# Altium schematic sheet SenorsIn.SchDoc
size A4; SheetNumber: 2; SheetTotal: 9
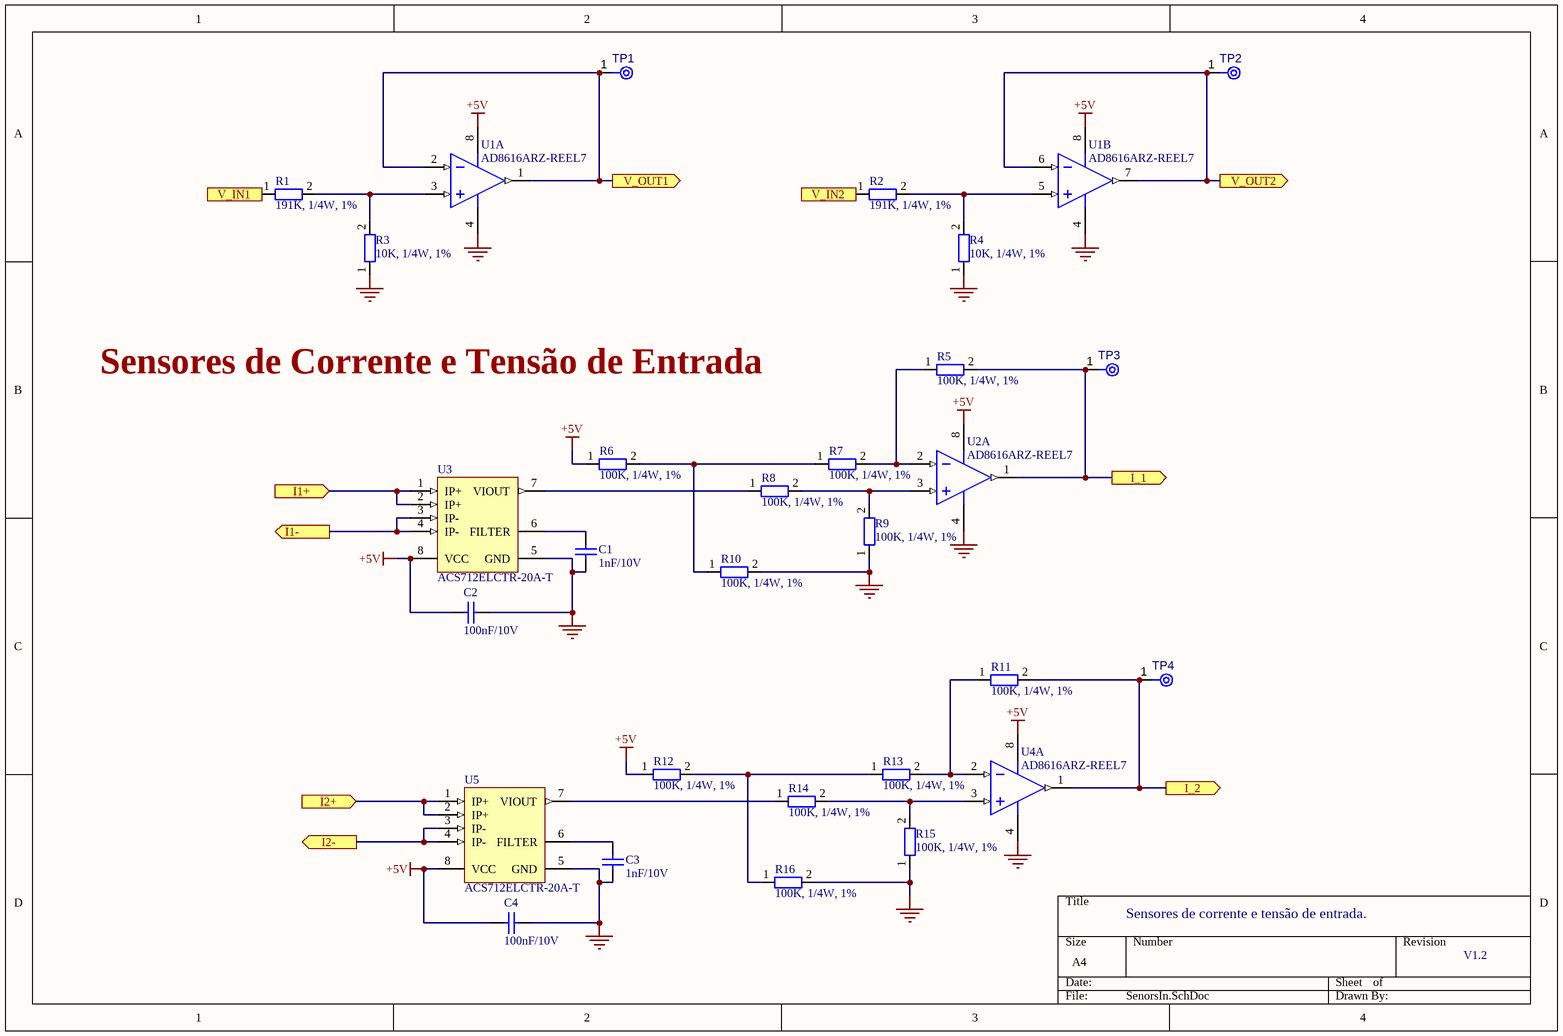
[diagram p0: SenorsIn.SchDoc]

## Parts
C1  value 1nF/10V  [C1206]  (hidden comment: Cap Semi)
C2  value 100nF/10V  [C1206]  (hidden comment: Cap Semi)
C3  value 1nF/10V  [C1206]  (hidden comment: Cap Semi)
C4  value 100nF/10V  [C1206]  (hidden comment: Cap Semi)
R1  191K, 1/4W, 1%  [RESC3216X60N]
R2  191K, 1/4W, 1%  [RESC3216X60N]
R3  10K, 1/4W, 1%  [RES-0805]
R4  10K, 1/4W, 1%  [RES-0805]
R5  100K, 1/4W, 1%  [RES-0805]
R6  100K, 1/4W, 1%  [RES-0805]
R7  100K, 1/4W, 1%  [RES-0805]
R8  100K, 1/4W, 1%  [RES-0805]
R9  100K, 1/4W, 1%  [RES-0805]
R10  100K, 1/4W, 1%  [RES-0805]
R11  100K, 1/4W, 1%  [RES-0805]
R12  100K, 1/4W, 1%  [RES-0805]
R13  100K, 1/4W, 1%  [RES-0805]
R14  100K, 1/4W, 1%  [RES-0805]
R15  100K, 1/4W, 1%  [RES-0805]
R16  100K, 1/4W, 1%  [RES-0805]
TP1  TPAD6R  [TP06R]  (value not drawn)  (no BOM)
TP2  TPAD6R  [TP06R]  (value not drawn)  (no BOM)
TP3  TPAD6R  [TP06R]  (value not drawn)  (no BOM)
TP4  TPAD6R  [TP06R]  (value not drawn)  (no BOM)
U1  AD8616ARZ-REEL7  [ADI-R-8_M]  (parts A,B of 2)
U2  AD8616ARZ-REEL7  [ADI-R-8_N]  (part A of 2)
U3  ACS712ELCTR-20A-T  [ALEG-LC-8_V]
U4  AD8616ARZ-REEL7  [ADI-R-8_N]  (part A of 2)
U5  ACS712ELCTR-20A-T  [ALEG-LC-8_V]

## Ports
I1+ (in), I1- (out), I2+ (in), I2- (out), I_1 (out), I_2 (out), V_IN1 (in), V_IN2 (in), V_OUT1 (out), V_OUT2 (out)

## Nets
+5V: C2.2 C4.2 R6.1 R12.1 U1.8(+V) U2.8(+V) U3.8(VCC) U4.8(+V) U5.8(VCC)
GND: C1.1 C2.1 C3.1 C4.1 R3.1 R4.1 R9.1 R10.2 R15.1 R16.2 U1.4(-V) U2.4(-V) U3.5(GND) U4.4(-V) U5.5(GND)
I1+: U3.1(IP+) U3.2(IP+) ; port I1+
I1-: U3.3(IP-) U3.4(IP-) ; port I1-
I2+: U5.1(IP+) U5.2(IP+) ; port I2+
I2-: U5.3(IP-) U5.4(IP-) ; port I2-
I_1: R5.2 TP3.1(TP) U2.1(OUT_A) ; port I_1
I_2: R11.2 TP4.1(TP) U4.1(OUT_A) ; port I_2
V_IN1: R1.1 ; port V_IN1
V_IN2: R2.1 ; port V_IN2
V_OUT1: TP1.1(TP) U1.1(OUT_A) U1.2(-IN_A) ; port V_OUT1
V_OUT2: TP2.1(TP) U1.6(-IN_B) U1.7(OUT_B) ; port V_OUT2
NetC1_2: C1.2 U3.6(FILTER)
NetC3_2: C3.2 U5.6(FILTER)
NetR1_2: R1.2 R3.2 U1.3(+IN_A)
NetR2_2: R2.2 R4.2 U1.5(+IN_B)
NetR5_1: R5.1 R7.2 U2.2(-IN_A)
NetR6_2: R6.2 R7.1 R10.1
NetR8_1: R8.1 U3.7(VIOUT)
NetR8_2: R8.2 R9.2 U2.3(+IN_A)
NetR11_1: R11.1 R13.2 U4.2(-IN_A)
NetR12_2: R12.2 R13.1 R16.1
NetR14_1: R14.1 U5.7(VIOUT)
NetR14_2: R14.2 R15.2 U4.3(+IN_A)

## Notes on the sheet
- Sensores de Corrente e Tensão de Entrada
- Sensores de corrente e tensão de entrada.
- V1.2

## Library data of the parts
C1 C3 = Cap Semi: KEMET - C0805C102K8RACTU - MLCC CAPACITOR, 1000PF, 10V, X7R, 10%, 0805, FULL REEL; Dielectric Material: Ceramic; Capacitance: 1nF; Published: 8-Jun-2000; LatestRevisionDate: 29-May-2009; LatestRevisionNote: IPC-7351 Footprint Added.; PackageReference: C1206; Publisher: Altium Limited; PackageDescription: Chip Capacitor; Supplier 1: Mouser; Supplier Part Number 1: 80-C0805C102K8R; Manufacturer: KEMET; Manufacturer Part Number: C0805C102K8RACTU; RoHS: Yes; Category: Ceramic Capacitors; Stock 1: 10223; Pricing 1: 1=0.30000, 10=0.15600, 50=0.15600, 100=0.09300, 1000=0.07300, 10000=0.05100 (USD); Mount: Surface Mount; Case/Package: 0805; Case Code (Metric): 2012; Case Code (Imperial): 0805; Contact Plating: Tin,Matte; Min Operating Temperature: -55°C; Max Operating Temperature: 125°C; Voltage Rating: 10V; Tolerance: 10%; Packaging: Tape and Reel; Package Quantity: 1; Voltage Rating (DC): 10V; Dielectric: X7R; Termination: SMD/SMT; Series: C; Construction: Flat; Length: 2mm; Width: 0.049inch; Height: 0.78mm; Thickness: 0.035inch; REACH SVHC: No SVHC; RoHS Compliant: Yes; ComponentLink1URL: http://www.mouser.com/ds/2/212/KEM_C1002_X7R_SMD-1102033.pdf?src-supplier=Mouser; ComponentLink1Description: http://www.mouser.com/ds/2/212/KEM_C1002_X7R_SMD-1102033.pdf?src-supplier=Mouser; ComponentLink2URL: https://search.kemet.com/component-edge/download/datasheet/C0805C102K8RACTU.pdf?src-supplier=Digi-Key; ComponentLink2Description: https://search.kemet.com/component-edge/download/datasheet/C0805C102K8RACTU.pdf?src-supplier=Digi-Key; ComponentLink3URL: https://api.kemet.com/component-edge/download/datasheet/C0805C102K8RACTU.pdf?src-supplier=Digi-Key; ComponentLink3Description: https://api.kemet.com/component-edge/download/datasheet/C0805C102K8RACTU.pdf?src-supplier=Digi-Key; ComponentLink4URL: http://capacitoredge.kemet.com/capedge2/DataSheet?pn=C0805C102K8RACTU&src-supplier=Avnet; ComponentLink4Description: http://capacitoredge.kemet.com/capedge2/DataSheet?pn=C0805C102K8RACTU&src-supplier=Avnet; ComponentLink5URL: http://www.farnell.com/datasheets/2627200.pdf?src-supplier=Newark; ComponentLink5Description: http://www.farnell.com/datasheets/2627200.pdf?src-supplier=Newark
C2 C4 = Cap Semi: Multilayer Ceramic Capacitors MLCC - SMD/SMT 10volts 0.1uF X7R 20%; Manufacturer: KEMET; Manufacturer Part Number: C1206C104M8RACTU; Capacitance: 100nF; Voltage Rating: 10V; Published: 8-Jun-2000; LatestRevisionDate: 29-May-2009; LatestRevisionNote: IPC-7351 Footprint Added.; PackageReference: C1206; Publisher: Altium Limited; PackageDescription: Chip Capacitor; Supplier 1: Mouser; Supplier Part Number 1: 80-C1206C104M8R; RoHS: Yes; Category: Ceramic Capacitors; Stock 1: 1591; Pricing 1: 1=0.41000, 10=0.24000, 50=0.24000, 100=0.15000, 1000=0.12000, 10000=0.08000 (USD); Mount: Surface Mount; Case/Package: 1206; Case Code (Metric): 3216; Case Code (Imperial): 1206; Weight: 0.000571oz; Dielectric Material: Ceramic; Min Operating Temperature: -55°C; Max Operating Temperature: 125°C; Package Quantity: 4000; Tolerance: 20%; Packaging: Tape and Reel; Voltage Rating (DC): 10V; Dielectric: X7R; Termination: SMD/SMT; Series: C; Construction: Flat; Length: 3.2mm; Width: 0.063inch; Height: 0.78mm; Thickness: 0.035inch; Depth: 1.6mm; RoHS Compliant: Yes; ComponentLink1URL: http://www.mouser.com/ds/2/212/KEM_C1002_X7R_SMD-1102033.pdf?src-supplier=Mouser; ComponentLink1Description: http://www.mouser.com/ds/2/212/KEM_C1002_X7R_SMD-1102033.pdf?src-supplier=Mouser; ComponentLink2URL: http://components.arrow.com/part/dataview/3457921S8615974N7429?src-supplier=Arrow+Electronics; ComponentLink2Description: http://components.arrow.com/part/dataview/3457921S8615974N7429?src-supplier=Arrow+Electronics; ComponentLink3URL: https://search.kemet.com/component-edge/download/datasheet/C1206C104M8RACTU.pdf?src-supplier=Digi-Key; ComponentLink3Description: https://search.kemet.com/component-edge/download/datasheet/C1206C104M8RACTU.pdf?src-supplier=Digi-Key
R1 R2 = RES-1206: Res Thick Film 1206 191K Ohm 1% 0.25W(1/4W) ±100ppm/C Molded SMD Paper T/R; Manufacturer: Yageo; Manufacturer Part Number: RC1206FR-07191KL; Resistance: 191kR; Temperature Coefficient: 100ppm/°C; Power Rating: 250mW; Voltage Rating: 200V; Supplier 1: Mouser; Supplier Part Number 1: 603-RC1206FR-07191KL; RoHS: Yes; Category: Chip SMD Resistors; Stock 1: 10616; Pricing 1: 1=0.23000, 10=0.05400, 50=0.05400, 100=0.01900, 1000=0.01400, 10000=0.00800 (USD); Case/Package: 1206; Contact Plating: Tin,Matte; Case Code (Imperial): 1206; Case Code (Metric): 3216; Weight: 0.000571oz; Min Operating Temperature: -55°C; Max Operating Temperature: 155°C; Tolerance: 1%; Resistor Type: Thick Film; Packaging: Tape and Reel; Termination: SMD/SMT; Voltage Rating (DC): 200V; Features: Moisture Resistant; Series: RC; Max Power Dissipation: 250mW; Number of Terminations: 2; Construction: Rectangular; Length: 3.2mm; Width: 1.6mm; Height: 0.55mm; Depth: 1.6mm; Radiation Hardening: No; Military Standard: Not; Lead Free: Lead Free; RoHS Compliant: Yes; ComponentLink1URL: http://www.mouser.com/ds/2/447/PYu-RC1206_51_RoHS_L-4-349080.pdf?src-supplier=Mouser; ComponentLink1Description: http://www.mouser.com/ds/2/447/PYu-RC1206_51_RoHS_L-4-349080.pdf?src-supplier=Mouser; ComponentLink2URL: http://components.arrow.com/part/dataview/0323_00047427?src-supplier=Arrow+Europe; ComponentLink2Description: http://components.arrow.com/part/dataview/0323_00047427?src-supplier=Arrow+Europe; ComponentLink3URL: http://www.yageo.com/documents/recent/PYu-RC_Group_51_RoHS_L_2.pdf?src-supplier=Avnet; ComponentLink3Description: http://www.yageo.com/documents/recent/PYu-RC_Group_51_RoHS_L_2.pdf?src-supplier=Avnet; ComponentLink4URL: http://www.yageo.com.tw/exep/pages/download/literatures/PYu-R_INT-thick_7.pdf?src-supplier=Digi-Key; ComponentLink4Description: http://www.yageo.com.tw/exep/pages/download/literatures/PYu-R_INT-thick_7.pdf?src-supplier=Digi-Key; ComponentLink5URL: http://www.yageo.com/documents/recent/PYu-RC_Group_51_RoHS_L_9.pdf?src-supplier=Digi-Key; ComponentLink5Description: http://www.yageo.com/documents/recent/PYu-RC_Group_51_RoHS_L_9.pdf?src-supplier=Digi-Key; ComponentLink6URL: http://www.yageo.com/documents/recent/PYu-RC_Group_51_RoHS_L_10.pdf?src-supplier=Digi-Key; ComponentLink6Description: http://www.yageo.com/documents/recent/PYu-RC_Group_51_RoHS_L_10.pdf?src-supplier=Digi-Key; ComponentLink7URL: http://www.yageo.com/documents/recent/PYu-RC1206_51_RoHS_L_5.pdf?src-supplier=Avnet+Europe; ComponentLink7Description: http://www.yageo.com/documents/recent/PYu-RC1206_51_RoHS_L_5.pdf?src-supplier=Avnet+Europe
R3 R4 = Res-0805: Res Thick Film 2.0 x 1.2 mm 10K Ohm 1% 0.125W(1/8W) 100ppm/ C Molded SMD Paper T/R; Manufacturer_Name: YAGEO (PHYCOMP); Manufacturer_Part_Number: RC0805JR-131KL; Manufacturer: Yageo; Manufacturer Part Number: RC0805FR-1310KL; Resistance: 10kR; Temperature Coefficient: 100ppm/°C; Power Rating: 125mW; Voltage Rating: 150V; Datasheet Link: http://www.yageo.com/documents/recent/PYu-RC_Group_51_RoHS_L_10.pdf; Height: 0.6mm; Mouser Part Number: 603-RC0805JR-131KL; Mouser Price/Stock: https://www.mouser.com/Search/Refine.aspx?Keyword=603-RC0805JR-131KL; Supplier 1: Mouser; Supplier Part Number 1: 603-RC0805FR-1310KL; RoHS: Yes; Category: Chip SMD Resistors; Stock 1: 16417; Pricing 1: 1=0.13000, 10=0.03100, 50=0.03100, 100=0.01100, 1000=0.00800, 10000=0.00500 (USD); Case/Package: 0805; Number of Pins: 2; Contact Plating: Tin,Matte,Lead; Case Code (Imperial): 0805; Case Code (Metric): 2012; Min Operating Temperature: -55°C; Max Operating Temperature: 155°C; Tolerance: 1%; Resistor Type: Thick Film; Packaging: Tape and Reel; Termination: SMD/SMT; Voltage Rating (DC): 150V; Series: RC; Resistance Tolerance: 1%; Radiation Hardening: No; REACH SVHC: No SVHC; Lead Free: Lead Free; RoHS Compliant: Yes; ComponentLink1URL: http://www.farnell.com/datasheets/2167052.pdf?src-supplier=Farnell; ComponentLink1Description: http://www.farnell.com/datasheets/2167052.pdf?src-supplier=Farnell; ComponentLink2URL: http://www.mouser.com/ds/2/447/Yageo_08112016_RC0805-968729.pdf?src-supplier=Mouser; ComponentLink2Description: http://www.mouser.com/ds/2/447/Yageo_08112016_RC0805-968729.pdf?src-supplier=Mouser; ComponentLink3URL: http://components.arrow.com/part/dataview/0323_00200993?src-supplier=Arrow+Europe; ComponentLink3Description: http://components.arrow.com/part/dataview/0323_00200993?src-supplier=Arrow+Europe; ComponentLink4URL: http://www.yageo.com/pdf/PYu-RC0805_51_RoHS_L_4.pdf?src-supplier=Avnet; ComponentLink4Description: http://www.yageo.com/pdf/PYu-RC0805_51_RoHS_L_4.pdf?src-supplier=Avnet; ComponentLink5URL: http://www.yageo.com/documents/recent/PYu-RC0805_51_RoHS_L_5.pdf?src-supplier=Avnet+Europe; ComponentLink5Description: http://www.yageo.com/documents/recent/PYu-RC0805_51_RoHS_L_5.pdf?src-supplier=Avnet+Europe; ComponentLink6URL: http://www.farnell.com/datasheets/2167052.pdf?src-supplier=Element14; ComponentLink6Description: http://www.farnell.com/datasheets/2167052.pdf?src-supplier=Element14; ComponentLink7URL: http://www.farnell.com/datasheets/2167052.pdf?src-supplier=Newark; ComponentLink7Description: http://www.farnell.com/datasheets/2167052.pdf?src-supplier=Newark
R5-R16 = Res-0805: Res Thick Film 0805 100K Ohm 1% 1/4W ±200ppm/°C Molded SMD Paper T/R; Manufacturer_Name: YAGEO (PHYCOMP); Manufacturer_Part_Number: RC0805JR-131KL; Manufacturer: Yageo; Manufacturer Part Number: RC0805FR-7W100KL; Datasheet Link: http://www.yageo.com/documents/recent/PYu-RC_Group_51_RoHS_L_10.pdf; Height: 0.6mm; Mouser Part Number: 603-RC0805JR-131KL; Mouser Price/Stock: https://www.mouser.com/Search/Refine.aspx?Keyword=603-RC0805JR-131KL; Supplier 1: Mouser; Supplier Part Number 1: 603-RC0805FR-7W100KL; RoHS: Yes; Category: Chip SMD Resistors; Stock 1: 8375; Pricing 1: 1=0.18000, 10=0.11500, 50=0.11500, 100=0.03700, 1000=0.02600, 10000=0.02600 (USD); RoHS Compliant: Yes
TP1-TP4 = CMP-00028-00002-2: 0.6mm round; Pins: 1
U1 U2 U4 = CMP-0384-00618-1: Double Channel Wide Bandwidth Operational Amplifier, 24 MHz BW, 12 V/us SR, Industrial, 8-pin SOIC (R-8), Reel; Generic Part Number: AD8616; Manufacturer: Analog Devices; Amplifiers Per Package: 2; Iq/Amp: 2mA; Small Signal Bandwidth: 24MHz; V Span Max: 6V; Input Offset Voltage: 23uV; Input Bias Current: 200fA; V Span Min: 2.7V; Slew Rate: 12V/us; Common Mode Rejection Ratio: 100dB; Max Supply Voltage: 5V; Voltage Gain: 123.52dB; Operating Supply Voltage: 3V; Input Offset Voltage (Vos): 60uV; Operating Supply Current: 4mA; Output Current per Channel: 150mA; Input Voltage Noise Density: 10nV/sqrt Hz; Power Supply Rejection Ratio (PSRR): 90dB; Input Capacitance: 10pF; Settling Time: 500ns; Amplifier Type: GENERAL PURPOSE; ComponentLink2Description: Datasheet; ComponentLink1URL: http://www.analog.com/en/index.html; PackageDescription: 8-Pin Standard Small Outline Package, Body 3.9 x 4.9 mm, Pitch 1.27 mm; Code_JEDEC: MS-012-AA; PackageReference: R-8; Mounting Technology: Surface Mount; ComponentLink2URL: http://www.analog.com/static/imported-files/data_sheets/AD8615_8616_8618.pdf; ComponentLink3Description: Package Specification; PackageVersion: 060506-A; ComponentLink1Description: Manufacturer URL; ComponentLink3URL: http://www.analog.com/static/imported-files/packages/PKG_PDF/SOIC_Narrow%20(R)/R_8.pdf; DatasheetVersion: Rev. E; PartNumber: AD8616ARZ-REEL7; Supplier 1: Mouser; Supplier Part Number 1: 584-AD8616ARZ-R7; Manufacturer Part Number: AD8616ARZ-REEL7; RoHS: Yes; Category: Amplifiers - Op Amps, Buffer, Instrumentation; Pricing 1: 1=3.82000, 10=3.44000, 50=3.25000, 100=2.82000, 1000=2.03000, 10000=1.97000 (USD); Case/Package: R; Number of Pins: 8; Contact Plating: Tin,Matte; Min Operating Temperature: -40°C; Max Operating Temperature: 125°C; Min Supply Voltage: 2.7V; Gain Bandwidth Product: 24MHz; Packaging: Tape and Reel; Unity Gain Bandwidth Product: 24MHz; Package Quantity: 1; Number of Circuits: 2; Number of Channels: 2; Number of Elements: 2; Max Supply Current: 4mA; Quiescent Current: 2mA; Number of Amplifiers: 2; Series: DigiTrim®; Technology: CMOS; Length: 5mm; Width: 4mm; Height: 1.5mm; Lead Free: Contains Lead; RoHS Compliant: Yes; ComponentLink4URL: https://datasheet.ciiva.com/15374/ad8615-8616-8618-243269-15374309.pdf?src-supplier=Mouser; ComponentLink4Description: https://datasheet.ciiva.com/15374/ad8615-8616-8618-243269-15374309.pdf?src-supplier=Mouser; ComponentLink5URL: https://datasheet.ciiva.com/11711/ad8615-8616-8618-11711337.pdf?src-supplier=Avnet; ComponentLink5Description: https://datasheet.ciiva.com/11711/ad8615-8616-8618-11711337.pdf?src-supplier=Avnet; ComponentLink6URL: https://datasheet.ciiva.com/6629/ad8615-8616-8618-6629773.pdf?src-supplier=Digi-Key; ComponentLink6Description: https://datasheet.ciiva.com/6629/ad8615-8616-8618-6629773.pdf?src-supplier=Digi-Key; ComponentLink7URL: https://datasheet.ciiva.com/6629/ad8615-8616-8618-6629775.pdf?src-supplier=Digi-Key; ComponentLink7Description: https://datasheet.ciiva.com/6629/ad8615-8616-8618-6629775.pdf?src-supplier=Digi-Key; ComponentLink8URL: https://datasheet.ciiva.com/17569/ad8615-8616-8618-17569678.pdf?src-supplier=Avnet+Europe; ComponentLink8Description: https://datasheet.ciiva.com/17569/ad8615-8616-8618-17569678.pdf?src-supplier=Avnet+Europe
U3 U5 = CMP-0826-00001-1: Linear Current Sensor IC, 4.5 to 5.5 V Supply Voltage, 10 mA Supply Current, -40 to 85 degC, 8-Pin SOIC (LC), RoHS, Tape and Reel; Manufacturer: Allegro Microsystems; CLOAD: 10 nF Max.; ICC: 10 mA; F: 80 kHz; RLOAD: 4.7 kOhm Min.; Optimized Accuracy Range: +/- 20 A; TR: 3.5 us; Sensitivity Sens: 100 mV/A Typ.; Operating Supply Voltage: 5V; Output Current: 10mA; Max Supply Current: 13mA; Min Supply Voltage: 4.5V; Max Supply Voltage: 5.5V; Bandwidth: 80kHz; Number of Channels: 1; Response Time: 5us; Polarity: Bidirectional; Accuracy: 1.5%; Current Sensing: 20A; Sensitivity: 100mV/A; Operating Temperature Range: -40 to 85 degC; ComponentLink2URL: http://www.allegromicro.com/~/media/Files/Datasheets/ACS712-Datasheet.ashx; ComponentLink1Description: Manufacturer URL; VCC: 4.5 to 5.5 V; Mounting Technology: Surface Mount; DatasheetVersion: Rev. 15; ComponentLink2Description: Datasheet; ComponentLink1URL: http://www.allegromicro.com/; PackageDescription: 8-Pin SOIC, Body 4.9 x 3.9 mm, Pitch 1.27 mm; PackageReference: LC-8; RoHS: TRUE; Packing: Tape and Reel; PartNumber: ACS712ELCTR-20A-T; Supplier 1: Newark; Supplier Part Number 1: 31M3133; Manufacturer Part Number: ACS712ELCTR-20A-T; Category: Magnetic Sensors; Stock 1: 1560; Pricing 1: 1=5.64000, 25=3.57000, 50=3.15000, 100=3.07000, 250=2.82000, 500=2.57000 (USD); Case/Package: SOIC; Number of Pins: 8; Min Operating Temperature: -40°C; Max Operating Temperature: 85°C; Package Quantity: 1; Frequency: 80kHz; Packaging: Tape and Reel; Termination: SMD/SMT; Quiescent Current: 10mA; Linearity: 1.5%; Series: -; Length: 4.9mm; Width: 3.9mm; Height: 1.5mm; Radiation Hardening: No; REACH SVHC: No SVHC; Lead Free: Lead Free; RoHS Compliant: Yes; ComponentLink3URL: https://datasheet.ciiva.com/15099/getdatasheetpartid-312820-15099471.pdf?src-supplier=Verical; ComponentLink3Description: https://datasheet.ciiva.com/15099/getdatasheetpartid-312820-15099471.pdf?src-supplier=Verical; ComponentLink4URL: https://datasheet.ciiva.com/3271/acs712-datasheet-3271995.pdf?src-supplier=Avnet; ComponentLink4Description: https://datasheet.ciiva.com/3271/acs712-datasheet-3271995.pdf?src-supplier=Avnet; ComponentLink5URL: https://datasheet.ciiva.com/3272/acs712-datasheet-3272423.pdf?src-supplier=Avnet; ComponentLink5Description: https://datasheet.ciiva.com/3272/acs712-datasheet-3272423.pdf?src-supplier=Avnet; ComponentLink6URL: https://datasheet.ciiva.com/16636/acs712-datasheet-16636599.pdf?src-supplier=Avnet+Europe; ComponentLink6Description: https://datasheet.ciiva.com/16636/acs712-datasheet-16636599.pdf?src-supplier=Avnet+Europe; ComponentLink7URL: https://datasheet.ciiva.com/1165/64754-1165093.pdf?src-supplier=Element14; ComponentLink7Description: https://datasheet.ciiva.com/1165/64754-1165093.pdf?src-supplier=Element14